# Altium schematic sheet MCU.SchDoc: MISKO 3.0
size A4; Date: 19.9.2021; Author: AMADEJ PAPEŽ; SheetNumber: 11; SheetTotal: 13; Version: V1.1; SheetTitle: MCU
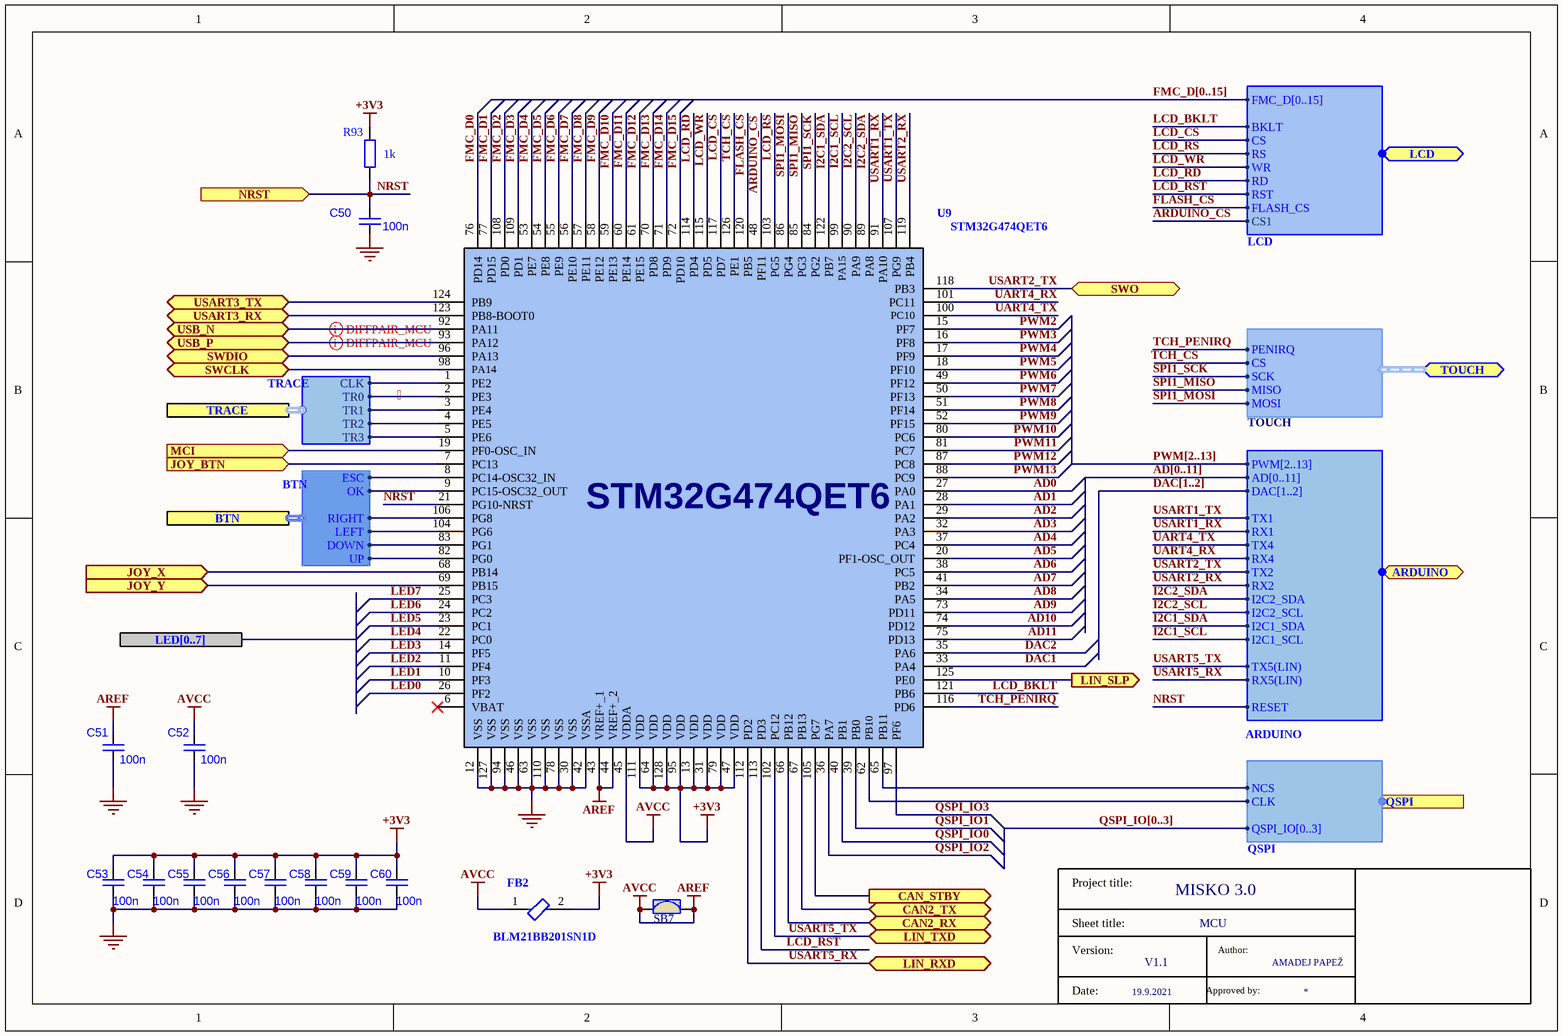
[diagram p0: MCU.SchDoc]

## Parts
C50  value 100n  [C0603]
C51  value 100n  [C0603]
C52  value 100n  [C0603]
C53  value 100n  [C0603]
C54  value 100n  [C0603]
C55  value 100n  [C0603]
C56  value 100n  [C0603]
C57  value 100n  [C0603]
C58  value 100n  [C0603]
C59  value 100n  [C0603]
C60  value 100n  [C0603]
FB2  BLM21BB201SN1D  [BLM2102FB0805]
R93  value 1k  [R1608_0603I_L]
SB7  SD_JUMP  [SOLDER_JUMPER]  (value not drawn)
T11  (no value)
U9  STM32G474QET6  [QFP40P1600X1600X160-128N]

## Ports
ARDUINO (bidir, harness ARDUINO), BTN (harness BTN), CAN2_RX (bidir), CAN2_TX (bidir), CAN_STBY (out), JOY_BTN (in), JOY_X (in), JOY_Y (in), LCD (bidir, harness LCD), LED[0..7] (harness LED), LIN_RXD (bidir), LIN_SLP (out), LIN_TXD (bidir), MCI (in), NRST (in), QSPI (harness QSPI), SWCLK (bidir), SWDIO (bidir), SWO (bidir), TOUCH (bidir, harness TOUCH), TRACE (harness TRACE), USART3_RX (bidir), USART3_TX (bidir), USB_N (bidir), USB_P (bidir)

## Harnesses
ARDUINO: PWM[2..13], DAC[1..2], TX1, RX1, TX4, RX4, TX2, RX2, I2C2_SDA, I2C2_SCL, I2C1_SDA, I2C1_SCL, AD[0..11], TX5(LIN), RX5(LIN), RESET
QSPI: NCS, CLK, QSPI_IO[0..3]
TRACE: CLK, TR0, TR1, TR2, TR3
BTN: LEFT, DOWN, RIGHT, UP, OK, ESC
LCD: FMC_D[0..15], RST, BKLT, RD, WR, RS, CS, FLASH_CS, CS1
TOUCH: PENIRQ, CS, SCK, MISO, MOSI

## Nets
+3V3: C53.2 C54.2 C55.2 C56.2 C57.2 C58.2 C59.2 C60.2 FB2.2 R93.1 U9.13(VDD) U9.31(VDD) U9.47(VDD) U9.64(VDD) U9.79(VDD) U9.95(VDD) U9.111(VDD) U9.128(VDD)
AREF: C51.2 C52.2 FB2.1 SB7.1 SB7.2 U9.43(VREF+_1) U9.44(VREF+_2) U9.45(VDDA)  [also labelled AVCC]
GND: C50.1 C51.1 C52.1 C53.1 C54.1 C55.1 C56.1 C57.1 C58.1 C59.1 C60.1 U9.12(VSS) U9.30(VSS) U9.42(VSSA) U9.46(VSS) U9.63(VSS) U9.78(VSS) U9.94(VSS) U9.110(VSS) U9.127(VSS)
AD0: U9.27(PA0)
AD1: U9.28(PA1)
AD2: U9.29(PA2)
AD3: U9.32(PA3)
AD4: U9.37(PC4)
AD5: U9.20(PF1-OSC_OUT)
AD6: U9.38(PC5)
AD7: U9.41(PB2)
AD8: U9.34(PA5)
AD9: U9.73(PD11)
AD10: U9.74(PD12)
AD11: U9.75(PD13)
ARDUINO_CS: U9.48(PF11) ; port LCD.CS1
CAN2_RX: U9.66(PB12) ; port CAN2_RX
CAN2_TX: U9.67(PB13) ; port CAN2_TX
CAN_STBY: U9.105(PG7) ; port CAN_STBY
DAC1: U9.33(PA4)
DAC2: U9.35(PA6)
FLASH_CS: U9.120(PB5) ; port LCD.FLASH_CS
FMC_D0: U9.76(PD14)
FMC_D1: U9.77(PD15)
FMC_D2: U9.108(PD0)
FMC_D3: U9.109(PD1)
FMC_D4: U9.53(PE7)
FMC_D5: U9.54(PE8)
FMC_D6: U9.55(PE9)
FMC_D7: U9.56(PE10)
FMC_D8: U9.57(PE11)
FMC_D9: U9.58(PE12)
FMC_D10: U9.59(PE13)
FMC_D11: U9.60(PE14)
FMC_D12: U9.61(PE15)
FMC_D13: U9.70(PD8)
FMC_D14: U9.71(PD9)
FMC_D15: U9.72(PD10)
I2C1_SCL: U9.99(PA15) ; port ARDUINO.I2C1_SCL
I2C1_SDA: U9.122(PB7) ; port ARDUINO.I2C1_SDA
I2C2_SCL: U9.90(PA9) ; port ARDUINO.I2C2_SCL
I2C2_SDA: U9.89(PA8) ; port ARDUINO.I2C2_SDA
JOY_BTN: U9.7(PC13) ; port JOY_BTN
JOY_X: U9.68(PB14) ; port JOY_X
JOY_Y: U9.69(PB15) ; port JOY_Y
LCD_BKLT: U9.121(PB6) ; port LCD.BKLT
LCD_CS: U9.117(PD7) ; port LCD.CS
LCD_RD: U9.114(PD4) ; port LCD.RD
LCD_RS: U9.103(PG5) ; port LCD.RS
LCD_RST: U9.113(PD3) ; port LCD.RST
LCD_WR: U9.115(PD5) ; port LCD.WR
LED0: U9.26(PF2)
LED1: U9.10(PF3)
LED2: U9.11(PF4)
LED3: U9.14(PF5)
LED4: U9.22(PC0)
LED5: U9.23(PC1)
LED6: U9.24(PC2)
LED7: U9.25(PC3)
LIN_SLP: U9.125(PE0) ; port LIN_SLP
MCI: U9.19(PF0-OSC_IN) ; port MCI
NRST: C50.2 R93.2 U9.21(PG10-NRST) ; port NRST, port ARDUINO.RESET
PWM2: U9.15(PF7)
PWM3: U9.16(PF8)
PWM4: U9.17(PF9)
PWM5: U9.18(PF10)
PWM6: U9.49(PF12)
PWM7: U9.50(PF13)
PWM8: U9.51(PF14)
PWM9: U9.52(PF15)
PWM10: U9.80(PC6)
PWM11: U9.81(PC7)
PWM12: U9.87(PC8)
PWM13: U9.88(PC9)
QSPI_IO0: U9.40(PB1)
QSPI_IO1: U9.39(PB0)
QSPI_IO2: U9.36(PA7)
QSPI_IO3: U9.97(PF6)
SPI1_MISO: U9.85(PG3) ; port TOUCH.MISO
SPI1_MOSI: U9.86(PG4) ; port TOUCH.MOSI
SPI1_SCK: U9.84(PG2) ; port TOUCH.SCK
SWCLK: U9.98(PA14) ; port SWCLK
SWDIO: U9.96(PA13) ; port SWDIO
TCH_CS: U9.126(PE1) ; port TOUCH.CS
TCH_PENIRQ: U9.116(PD6) ; port TOUCH.PENIRQ
UART4_RX: U9.101(PC11) ; port ARDUINO.RX4
UART4_TX: U9.100(PC10) ; port ARDUINO.TX4
USART1_RX: U9.91(PA10) ; port ARDUINO.RX1
USART1_TX: U9.107(PG9) ; port ARDUINO.TX1
USART2_RX: U9.119(PB4) ; port ARDUINO.RX2
USART2_TX: U9.118(PB3) ; port SWO, port ARDUINO.TX2
USART3_RX: U9.123(PB8-BOOT0) ; port USART3_RX
USART3_TX: U9.124(PB9) ; port USART3_TX
USART5_RX: U9.112(PD2) ; port LIN_RXD, port ARDUINO.RX5(LIN)
USART5_TX: U9.102(PC12) ; port LIN_TXD, port ARDUINO.TX5(LIN)
USB_N: U9.92(PA11) ; port USB_N
USB_P: U9.93(PA12) ; port USB_P
NetU9_1: U9.1(PE2) ; port TRACE.CLK
NetU9_2: U9.2(PE3) ; port TRACE.TR0
NetU9_3: U9.3(PE4) ; port TRACE.TR1
NetU9_4: U9.4(PE5) ; port TRACE.TR2
NetU9_5: U9.5(PE6) ; port TRACE.TR3
NetU9_8: U9.8(PC14-OSC32_IN) ; port BTN.ESC
NetU9_9: U9.9(PC15-OSC32_OUT) ; port BTN.OK
NetU9_62: U9.62(PB10) ; port QSPI.CLK
NetU9_65: U9.65(PB11) ; port QSPI.NCS
NetU9_82: U9.82(PG0) ; port BTN.UP
NetU9_83: U9.83(PG1) ; port BTN.DOWN
NetU9_104: U9.104(PG6) ; port BTN.LEFT
NetU9_106: U9.106(PG8) ; port BTN.RIGHT

Not connected (* = marked no-connect by the designer): U9 6(VBAT)*

## Buses and harness runs
bus AD[0..11]
bus DAC[1..2]
bus FMC_D[0..15]
bus PWM[2..13]
bus QSPI_IO[0..3]

## Layout directives
differential pair: USB_N, USB_P

## Notes on the sheet
- Labels drawn without touching a wire or pin: 
- (in symbol Title block) Project title:; Sheet title:; Version:; Author:; Date:; Approved by:

## Library data of the parts
C50-C60 = C: Capacitor; Code: NB6-100N
FB2 = BLM21BB201SN1D: Chip Ferrite Bead, 0805, 200Ω @ 100MHz, 0.26Ω, 25%, 500mA; Number of Circuits: 1; Shielding: Unshielded; DC Resistance (DCR): 260mR; Material: Steel; DC Resistance-Max: 350mR; Impedance: 200R; Max DC Current: 200mA; Code: LZ-FB0805; Max Operating Temperature: 125°C; Packaging: Tape and Reel; REACH SVHC: No SVHC; Depth: 1.25mm; Core Material: Ferrite; Case Code (Metric): 2012; Termination: SMD/SMT; Series: BLM21B; Number of Lines: 1; Max Current Rating: 500mA; Package Quantity: 4000; Lead Free: Lead Free; Test Frequency: 100MHz; Case Code (Imperial): 0805; Number of Pins: 2; Height: 0.85mm; Tolerance: 25%; Width: 1.25mm; Case/Package: 0805; Min Operating Temperature: -55°C; Current Rating: 500mA; Length: 2mm
R93 = R: Code: LC4-1K
T11 = Title block
U9 = STM32G474QET6: Mainstream Arm Cortex - M3 MCU 170Mhz with 512 Kbytes of Flash memory, Math Accelerator, HR timer, High Analog level integration / DataSheet: / https://www.st.com/en/microcontrollers-microprocessors/stm32g474qe.html; Manufacturer_Name: STMicroelectronics; Code: BSTM32G474QET6; Datasheet Link: https://componentsearchengine.com/Datasheets/1/STM32G474QET6.pdf; Height: 1.6mm; Manufacturer_Part_Number: STM32G474QET6; Mouser Part Number: 511-STM32G474QET6; Mouser Price/Stock: https://www.mouser.co.uk/ProductDetail/STMicroelectronics/STM32G474QET6?qs=PzGy0jfpSMtk6tieSqAtNg%3D%3D; Arrow Part Number: STM32G474QET6; Arrow Price/Stock: https://www.arrow.com/en/products/stm32g474qet6/stmicroelectronics?region=nac